# Altium schematic sheet 12.SchDoc
size 513 x 386 mm
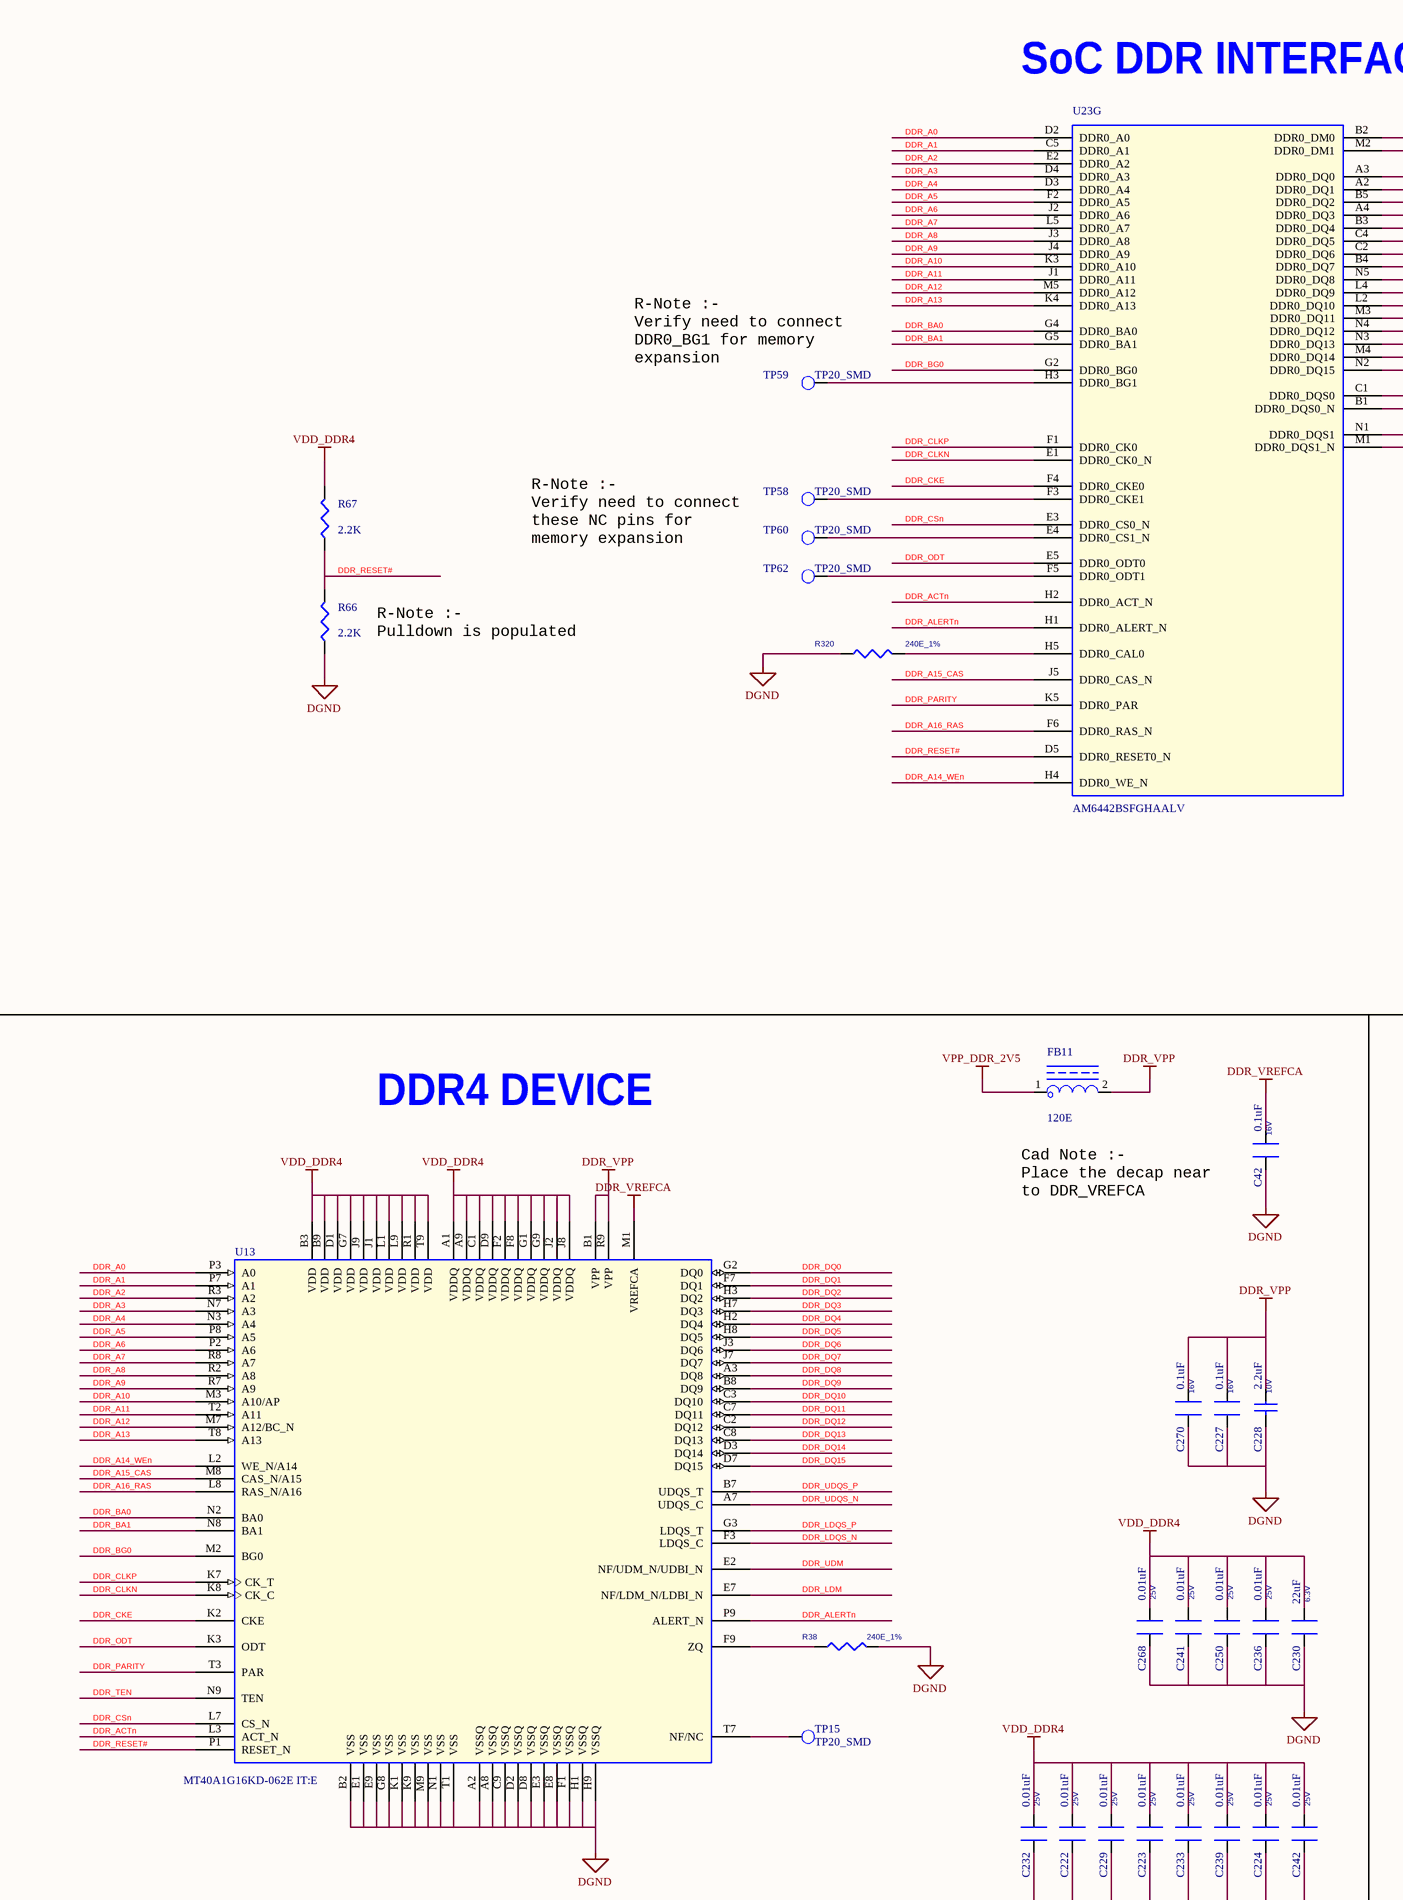
[diagram p0: 12.SchDoc, top left]
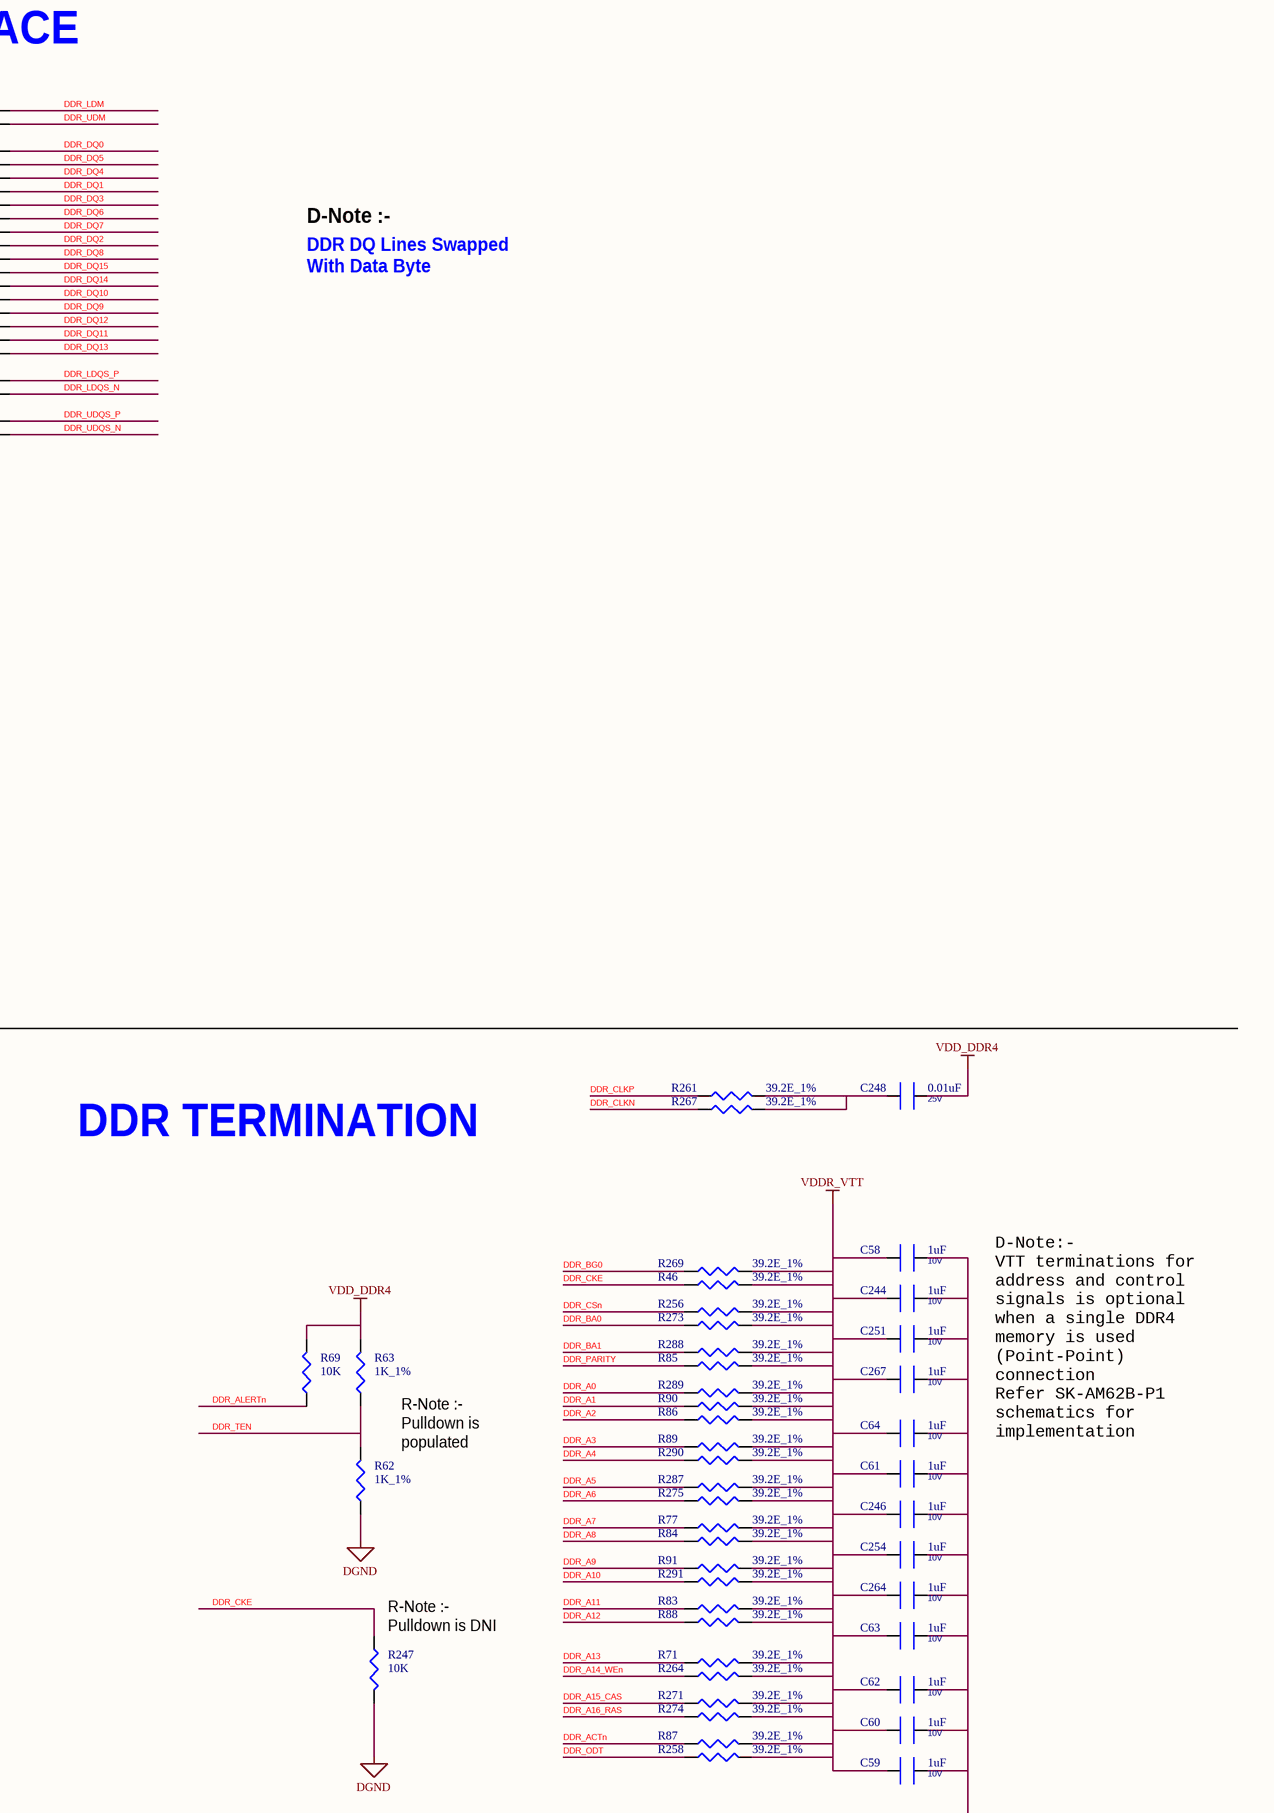
[diagram p1: 12.SchDoc, top right]
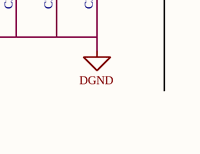
[diagram p2: 12.SchDoc, bottom left]
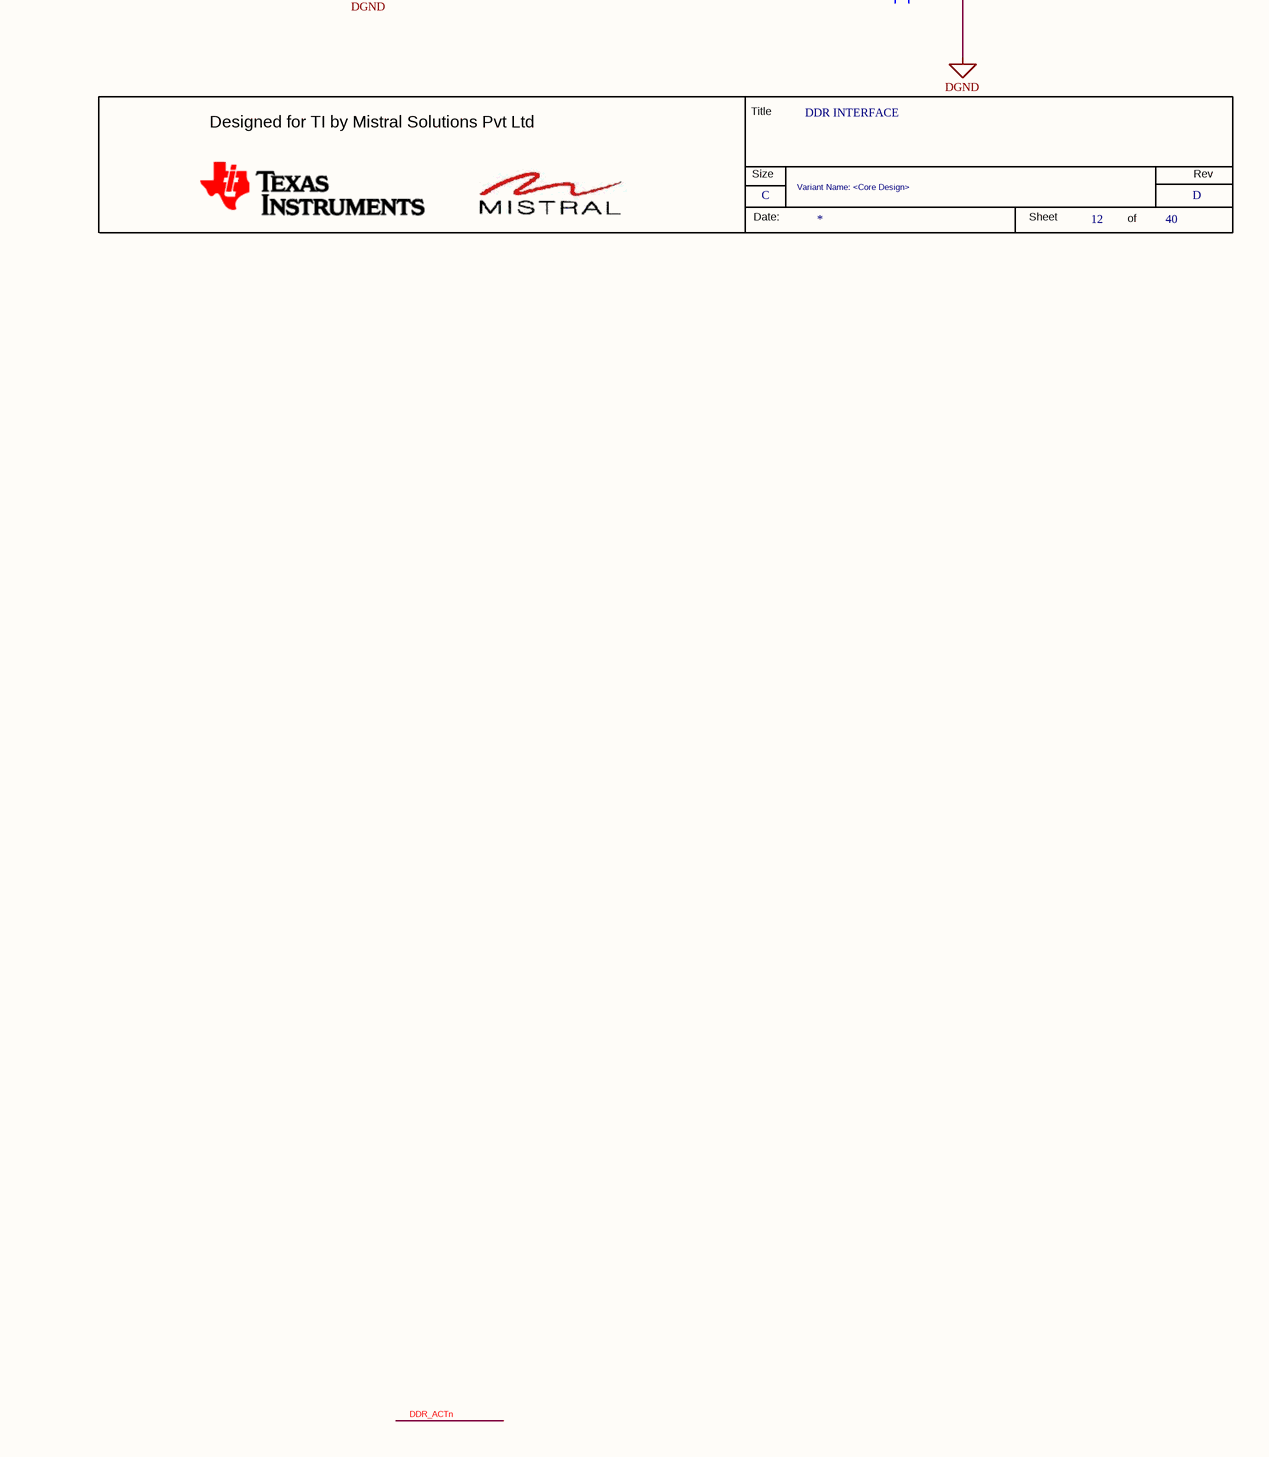
[diagram p3: 12.SchDoc, bottom right]

## Parts
*  RevCode: D  Title: DDR INTERFACE  Page Size: C  Page Number: 12  Page Count: 40  Variant Name: <Core Design>  (hidden comment: MISTRAL_TITLEBLK_CSIZE)  (graphical)
C42  0.1uF  Voltage: 16V  [CAP0402N]
C58  1uF  Voltage: 10V  [CAP0402N]
C59  1uF  Voltage: 10V  [CAP0402N]
C60  1uF  Voltage: 10V  [CAP0402N]
C61  1uF  Voltage: 10V  [CAP0402N]
C62  1uF  Voltage: 10V  [CAP0402N]
C63  1uF  Voltage: 10V  [CAP0402N]
C64  1uF  Voltage: 10V  [CAP0402N]
C222  0.01uF  Voltage: 25V  [CAP0402N]
C223  0.01uF  Voltage: 25V  [CAP0402N]
C224  0.01uF  Voltage: 25V  [CAP0402N]
C227  0.1uF  Voltage: 16V  [CAP0402N]
C228  2.2uF  Voltage: 10V  [CAP0402_0-75]
C229  0.01uF  Voltage: 25V  [CAP0402N]
C230  22uF  Voltage: 6.3V  [CAP0402N]
C232  0.01uF  Voltage: 25V  [CAP0402N]
C233  0.01uF  Voltage: 25V  [CAP0402N]
C236  0.01uF  Voltage: 25V  [CAP0402N]
C239  0.01uF  Voltage: 25V  [CAP0402N]
C241  0.01uF  Voltage: 25V  [CAP0402N]
C242  0.01uF  Voltage: 25V  [CAP0402N]
C244  1uF  Voltage: 10V  [CAP0402N]
C246  1uF  Voltage: 10V  [CAP0402N]
C248  0.01uF  Voltage: 25V  [CAP0402N]
C250  0.01uF  Voltage: 25V  [CAP0402N]
C251  1uF  Voltage: 10V  [CAP0402N]
C254  1uF  Voltage: 10V  [CAP0402N]
C264  1uF  Voltage: 10V  [CAP0402N]
C267  1uF  Voltage: 10V  [CAP0402N]
C268  0.01uF  Voltage: 25V  [CAP0402N]
C270  0.1uF  Voltage: 16V  [CAP0402N]
FB11  120E  [IND0603_1]
R38  240E_1%  [RES0402N]
R46  39.2E_1%  [RES0402_0-5]
R62  1K_1%  [RES0402_0-5]
R63  1K_1%  [RES0402_0-5]
R66  2.2K  [RES0402_0-5]
R67  2.2K  [RES0402_0-5]
R69  10K  [RES0402_0-5]
R71  39.2E_1%  [RES0402_0-5]
R77  39.2E_1%  [RES0402_0-5]
R83  39.2E_1%  [RES0402_0-5]
R84  39.2E_1%  [RES0402_0-5]
R85  39.2E_1%  [RES0402_0-5]
R86  39.2E_1%  [RES0402_0-5]
R87  39.2E_1%  [RES0402_0-5]
R88  39.2E_1%  [RES0402_0-5]
R89  39.2E_1%  [RES0402_0-5]
R90  39.2E_1%  [RES0402_0-5]
R91  39.2E_1%  [RES0402_0-5]
R247  10K  [RES0402_0-5]
R256  39.2E_1%  [RES0402_0-5]
R258  39.2E_1%  [RES0402_0-5]
R261  39.2E_1%  [RES0402_0-5]
R264  39.2E_1%  [RES0402_0-5]
R267  39.2E_1%  [RES0402_0-5]
R269  39.2E_1%  [RES0402_0-5]
R271  39.2E_1%  [RES0402_0-5]
R273  39.2E_1%  [RES0402_0-5]
R274  39.2E_1%  [RES0402_0-5]
R275  39.2E_1%  [RES0402_0-5]
R287  39.2E_1%  [RES0402_0-5]
R288  39.2E_1%  [RES0402_0-5]
R289  39.2E_1%  [RES0402_0-5]
R290  39.2E_1%  [RES0402_0-5]
R291  39.2E_1%  [RES0402_0-5]
R320  240E_1%  [RES0402N]
TP15  TP20_SMD  [TP20_SMD]
TP58  TP20_SMD  [TP20_SMD]
TP59  TP20_SMD  [TP20_SMD]
TP60  TP20_SMD  [TP20_SMD]
TP62  TP20_SMD  [TP20_SMD]
U13  MT40A1G16KD-062E IT:E  [FBGA96_31-49_520X360_1-2]
U23  AM6442BSFGHAALV  [FCBGA441_31-49_680X680_2-6]  (part G of 16)

## Nets
DDR_VPP: C227.2 C228.1 C270.2 FB11.2 U13.B1(VPP) U13.R9(VPP)
DDR_VREFCA: C42.2 U13.M1(VREFCA)
DGND: C42.1 C58.2 C59.2 C60.2 C61.2 C62.2 C63.2 C64.2 C222.2 C223.2 C224.2 C227.1 C228.2 C229.2 C230.2 C232.2 C233.2 C236.2 C239.2 C241.2 C242.2 C244.2 C246.2 C250.2 C251.2 C254.2 C264.2 C267.2 C268.2 C270.1 R38.2 R62.1 R66.1 R247.2 R320.2 U13.A2(VSSQ) U13.A8(VSSQ) U13.B2(VSS) U13.C9(VSSQ) U13.D2(VSSQ) U13.D8(VSSQ) U13.E1(VSS) U13.E3(VSSQ) U13.E8(VSSQ) U13.E9(VSS) U13.F1(VSSQ) U13.G8(VSS) U13.H1(VSSQ) U13.H9(VSSQ) U13.K1(VSS) U13.K9(VSS) U13.M9(VSS) U13.N1(VSS) U13.T1(VSS)
VDD_DDR4: C222.1 C223.1 C224.1 C229.1 C230.1 C232.1 C233.1 C236.1 C239.1 C241.1 C242.1 C248.2 C250.1 C268.1 R63.2 R67.2 R69.2 U13.A1(VDDQ) U13.A9(VDDQ) U13.B3(VDD) U13.B9(VDD) U13.C1(VDDQ) U13.D1(VDD) U13.D9(VDDQ) U13.F2(VDDQ) U13.F8(VDDQ) U13.G1(VDDQ) U13.G7(VDD) U13.G9(VDDQ) U13.J1(VDD) U13.J2(VDDQ) U13.J8(VDDQ) U13.J9(VDD) U13.L1(VDD) U13.L9(VDD) U13.R1(VDD) U13.T9(VDD)
VDDR_VTT: C58.1 C59.1 C60.1 C61.1 C62.1 C63.1 C64.1 C244.1 C246.1 C251.1 C254.1 C264.1 C267.1 R46.2 R71.2 R77.2 R83.2 R84.2 R85.2 R86.2 R87.2 R88.2 R89.2 R90.2 R91.2 R256.2 R258.2 R264.2 R269.2 R271.2 R273.2 R274.2 R275.2 R287.2 R288.2 R289.2 R290.2 R291.2
VPP_DDR_2V5: FB11.1
DDR_A0: R289.1 U13.P3(A0) U23.D2(DDR0_A0)
DDR_A1: R90.1 U13.P7(A1) U23.C5(DDR0_A1)
DDR_A2: R86.1 U13.R3(A2) U23.E2(DDR0_A2)
DDR_A3: R89.1 U13.N7(A3) U23.D4(DDR0_A3)
DDR_A4: R290.1 U13.N3(A4) U23.D3(DDR0_A4)
DDR_A5: R287.1 U13.P8(A5) U23.F2(DDR0_A5)
DDR_A6: R275.1 U13.P2(A6) U23.J2(DDR0_A6)
DDR_A7: R77.1 U13.R8(A7) U23.L5(DDR0_A7)
DDR_A8: R84.1 U13.R2(A8) U23.J3(DDR0_A8)
DDR_A9: R91.1 U13.R7(A9) U23.J4(DDR0_A9)
DDR_A10: R291.1 U13.M3(A10/AP) U23.K3(DDR0_A10)
DDR_A11: R83.1 U13.T2(A11) U23.J1(DDR0_A11)
DDR_A12: R88.1 U13.M7(A12/BC_N) U23.M5(DDR0_A12)
DDR_A13: R71.1 U13.T8(A13) U23.K4(DDR0_A13)
DDR_A14_WEn: R264.1 U13.L2(WE_N/A14) U23.H4(DDR0_WE_N)
DDR_A15_CAS: R271.1 U13.M8(CAS_N/A15) U23.J5(DDR0_CAS_N)
DDR_A16_RAS: R274.1 U13.L8(RAS_N/A16) U23.F6(DDR0_RAS_N)
DDR_ACTn: R87.1 U13.L3(ACT_N) U23.H2(DDR0_ACT_N)
DDR_ALERTn: R69.1 U13.P9(ALERT_N) U23.H1(DDR0_ALERT_N)
DDR_BA0: R273.1 U13.N2(BA0) U23.G4(DDR0_BA0)
DDR_BA1: R288.1 U13.N8(BA1) U23.G5(DDR0_BA1)
DDR_BG0: R269.1 U13.M2(BG0) U23.G2(DDR0_BG0)
DDR_CKE: R46.1 R247.1 U13.K2(CKE) U23.F4(DDR0_CKE0)
DDR_CLKN: R267.1 U13.K8(CK_C) U23.E1(DDR0_CK0_N)
DDR_CLKP: R261.1 U13.K7(CK_T) U23.F1(DDR0_CK0)
DDR_CSn: R256.1 U13.L7(CS_N) U23.E3(DDR0_CS0_N)
DDR_DQ0: U13.G2(DQ0) U23.A3(DDR0_DQ0)
DDR_DQ1: U13.F7(DQ1) U23.A4(DDR0_DQ3)
DDR_DQ2: U13.H3(DQ2) U23.B4(DDR0_DQ7)
DDR_DQ3: U13.H7(DQ3) U23.B3(DDR0_DQ4)
DDR_DQ4: U13.H2(DQ4) U23.B5(DDR0_DQ2)
DDR_DQ5: U13.H8(DQ5) U23.A2(DDR0_DQ1)
DDR_DQ6: U13.J3(DQ6) U23.C4(DDR0_DQ5)
DDR_DQ7: U13.J7(DQ7) U23.C2(DDR0_DQ6)
DDR_DQ8: U13.A3(DQ8) U23.N5(DDR0_DQ8)
DDR_DQ9: U13.B8(DQ9) U23.N4(DDR0_DQ12)
DDR_DQ10: U13.C3(DQ10) U23.M3(DDR0_DQ11)
DDR_DQ11: U13.C7(DQ11) U23.M4(DDR0_DQ14)
DDR_DQ12: U13.C2(DQ12) U23.N3(DDR0_DQ13)
DDR_DQ13: U13.C8(DQ13) U23.N2(DDR0_DQ15)
DDR_DQ14: U13.D3(DQ14) U23.L2(DDR0_DQ10)
DDR_DQ15: U13.D7(DQ15) U23.L4(DDR0_DQ9)
DDR_LDM: U13.E7(NF/LDM_N/LDBI_N) U23.B2(DDR0_DM0)
DDR_LDQS_N: U13.F3(LDQS_C) U23.B1(DDR0_DQS0_N)
DDR_LDQS_P: U13.G3(LDQS_T) U23.C1(DDR0_DQS0)
DDR_ODT: R258.1 U13.K3(ODT) U23.E5(DDR0_ODT0)
DDR_PARITY: R85.1 U13.T3(PAR) U23.K5(DDR0_PAR)
DDR_RESET#: R66.2 R67.1 U13.P1(RESET_N) U23.D5(DDR0_RESET0_N)
DDR_TEN: R62.2 R63.1 U13.N9(TEN)
DDR_UDM: U13.E2(NF/UDM_N/UDBI_N) U23.M2(DDR0_DM1)
DDR_UDQS_N: U13.A7(UDQS_C) U23.M1(DDR0_DQS1_N)
DDR_UDQS_P: U13.B7(UDQS_T) U23.N1(DDR0_DQS1)
NetC248_1: C248.1 R261.2 R267.2
NetR38_1: R38.1 U13.F9(ZQ)
NetR320_1: R320.1 U23.H5(DDR0_CAL0)
NetTP15_1: TP15.1(TP) U13.T7(NF/NC)
NetTP58_1: TP58.1(TP) U23.F3(DDR0_CKE1)
NetTP59_1: TP59.1(TP) U23.H3(DDR0_BG1)
NetTP60_1: TP60.1(TP) U23.E4(DDR0_CS1_N)
NetTP62_1: TP62.1(TP) U23.F5(DDR0_ODT1)

## Notes on the sheet
- SoC DDR INTERFACE
- DDR DQ Lines Swapped
  With Data Byte
- D-Note :-
- (near TP59) R-Note :-
  Verify need to connect
  DDR0_BG1 for memory
  expansion
- R-Note :-
  Verify need to connect
  these NC pins for
  memory expansion
- R-Note :-
  Pulldown is populated
- DDR4 DEVICE
- Cad Note :-
  Place the decap near
  to DDR_VREFCA
- DDR TERMINATION
- D-Note:-
  VTT terminations for
  address and control
  signals is optional
  when a single DDR4
  memory is used
  (Point-Point)
  connection
  Refer SK-AM62B-P1
  schematics for
  implementation
- R-Note :-
  Pulldown is
  populated
- (near R247) R-Note :-
  Pulldown is DNI
- (in symbol MISTRAL_TITLEBLK_CSIZE) Title; Designed for TI by Mistral Solutions Pvt Ltd; Size; Rev; Date:; Sheet; of

## Library data of the parts
* = MISTRAL_TITLEBLK_CSIZE: Issue: 1.0; Page Create Date: March  8, 1995; Page Modify Date: *
C42 = CAP_Dup2: CAP CERAMIC 0.1uF 16V 10% X5R 0201; Mistral Part No: 120009030072-R; Mfr_name: MURATA; Mfr_part_number: GRM033R61C104KE84J; Part_type: CAPACITORS\CERAMIC; MECHANICAL 3D STEP FILE: CAP0201_0-5; Wattage: NA; Project: TI_MAXIE_CPB; Customs_HS_Code: 85322990; Custom_Duty: 15%; Library Ref: CAP; Temperature: -55癈+85癈; Weight: 0.33mg; Tolerance: 10%; Package: 0201; Distributor_name: DIGIKEY; Distributor_part_number: 490-16742-1-ND; Height: 0.33MM; Datasheet: Y:\MIS_DATABASE\DATASHEETS\CAPACITORS\GRM033R61C104KE84.PDF; Crtd /date: MANIRAJA/120218; Chkd/date: MANIRAJA/120218; Footprint Ref: CAP0201_0-5; Library Path: Y:\MIS_DATABASE\Library\ALTIUM_TOOL\SCHEMATICS_PARTS\MS_DISCRETE_Library.schlib; Footprint Path: Y:\MIS_DATABASE\Library\ALTIUM_TOOL\PCB_FOOTPRINTS\Altium_Footprint_Lib.PcbLib; PCB Footprint: CAP0201_0-5
C58 C244 C267 = CAP_Dup2: CAP CERAMIC 1uF 10V 20% X5R 0402; Part_type: CAPACITORS\CERAMIC; Mfr_part_number: 885012105012; Mfr_name: WURTH ELECTRONICS; Mistral Part No: 120020080009-R; Custom_Duty: 15%; Customs_HS_Code: 85322990; Project: AM64x_EVM_BRD; Wattage: NA; MECHANICAL 3D STEP FILE: CAP0402_0-75; Chkd/date: MANIRAJA/210820; Crtd /date: ALVY/190820; Datasheet: Y:\MIS_DATABASE\DATASHEETS\CAPACITORS\885012105012.PDF; Height: 0.55MM; Distributor_part_number: 732-7489-1-ND; Distributor_name: DIGIKEY; Package: 0402; Tolerance: 20%; Weight: 0.65mg; Temperature: -55癈+85癈; Library Ref: CAP; Footprint Ref: CAP0402_0-75; Library Path: Y:\MIS_DATABASE\Library\ALTIUM_TOOL\SCHEMATICS_PARTS\MS_DISCRETE_Library.schlib; Footprint Path: Y:\MIS_DATABASE\Library\ALTIUM_TOOL\PCB_FOOTPRINTS\Altium_Footprint_Lib.PcbLib; PCB Footprint: CAP0402_0-75
C59 C62 C251 = CAP_Dup2: CAP CERAMIC 1uF 10V 20% X5R 0402; Mistral Part No: 120020080009-R; Mfr_name: WURTH ELECTRONICS; Mfr_part_number: 885012105012; Part_type: CAPACITORS\CERAMIC; Project: AM64x_EVM_BRD; Customs_HS_Code: 85322990; Custom_Duty: 15%; Wattage: NA; MECHANICAL 3D STEP FILE: CAP0402_0-75; Footprint Path: Y:\MIS_DATABASE\Library\ALTIUM_TOOL\PCB_FOOTPRINTS\Altium_Footprint_Lib.PcbLib; Library Path: Y:\MIS_DATABASE\Library\ALTIUM_TOOL\SCHEMATICS_PARTS\MS_DISCRETE_Library.schlib; Footprint Ref: CAP0402_0-75; Library Ref: CAP; Tolerance: 20%; Package: 0402; Distributor_name: DIGIKEY; Distributor_part_number: 732-7489-1-ND; Height: 0.55MM; Datasheet: Y:\MIS_DATABASE\DATASHEETS\CAPACITORS\885012105012.PDF; Crtd /date: ALVY/190820; Chkd/date: MANIRAJA/210820; Weight: 0.65mg; Temperature: -55癈+85癈; PCB Footprint: CAP0402_0-75
C60 C61 C63 C64 C246 C254 C264 = CAP_Dup2: CAP CERAMIC 1uF 10V 20% X5R 0402; Part_type: CAPACITORS\CERAMIC; Mfr_part_number: 885012105012; Mfr_name: WURTH ELECTRONICS; Mistral Part No: 120020080009-R; MECHANICAL 3D STEP FILE: CAP0402_0-75; Wattage: NA; Custom_Duty: 15%; Customs_HS_Code: 85322990; Project: AM64x_EVM_BRD; Footprint Path: Y:\MIS_DATABASE\Library\ALTIUM_TOOL\PCB_FOOTPRINTS\Altium_Footprint_Lib.PcbLib; Library Path: Y:\MIS_DATABASE\Library\ALTIUM_TOOL\SCHEMATICS_PARTS\MS_DISCRETE_Library.schlib; Footprint Ref: CAP0402_0-75; Library Ref: CAP; Temperature: -55癈+85癈; Weight: 0.65mg; Chkd/date: MANIRAJA/210820; Crtd /date: ALVY/190820; Datasheet: Y:\MIS_DATABASE\DATASHEETS\CAPACITORS\885012105012.PDF; Height: 0.55MM; Distributor_part_number: 732-7489-1-ND; Distributor_name: DIGIKEY; Package: 0402; Tolerance: 20%; PCB Footprint: CAP0402_0-75
C222-C224 C229 C232 C233 C236 C239 C241 C250 C268 = CAP_Dup2: CAP CERAMIC 0.01uF 25V 10% X5R 0201; Part_type: CAPACITORS\CERAMIC; Mfr_part_number: GRM033R61E103KA12J; Mfr_name: MURATA; Mistral Part No: 120018010007-R; MECHANICAL 3D STEP FILE: CAP0201_0-5; Wattage: NA; Custom_Duty: 15%; Customs_HS_Code: 85322990; Project: TI_MAXIE_CPB; Footprint Path: Y:\MIS_DATABASE\Library\ALTIUM_TOOL\PCB_FOOTPRINTS\Altium_Footprint_Lib.PcbLib; Library Path: Y:\MIS_DATABASE\Library\ALTIUM_TOOL\SCHEMATICS_PARTS\MS_DISCRETE_Library.schlib; Footprint Ref: CAP0201_0-5; Library Ref: CAP; Temperature: -55癈+85癈; Weight: 0.33mg; Chkd/date: MANIRAJA/230118; Crtd /date: MANIRAJA/230118; Datasheet: Y:\MIS_DATABASE\DATASHEETS\CAPACITORS\GRM033R61E103KA12.PDF; Height: 0.33MM; Distributor_part_number: GRM033R61E103KA12J-ND; Distributor_name: DIGIKEY; Package: 0201; Tolerance: 10%; PCB Footprint: CAP0201_0-5
C227 C270 = CAP_Dup2: CAP CERAMIC 0.1uF 16V 10% X5R 0201; Part_type: CAPACITORS\CERAMIC; Mfr_part_number: GRM033R61C104KE84J; Mfr_name: MURATA; Mistral Part No: 120009030072-R; Custom_Duty: 15%; Customs_HS_Code: 85322990; Project: TI_MAXIE_CPB; Wattage: NA; MECHANICAL 3D STEP FILE: CAP0201_0-5; Footprint Path: Y:\MIS_DATABASE\Library\ALTIUM_TOOL\PCB_FOOTPRINTS\Altium_Footprint_Lib.PcbLib; Library Path: Y:\MIS_DATABASE\Library\ALTIUM_TOOL\SCHEMATICS_PARTS\MS_DISCRETE_Library.schlib; Footprint Ref: CAP0201_0-5; Chkd/date: MANIRAJA/120218; Crtd /date: MANIRAJA/120218; Datasheet: Y:\MIS_DATABASE\DATASHEETS\CAPACITORS\GRM033R61C104KE84.PDF; Height: 0.33MM; Distributor_part_number: 490-16742-1-ND; Distributor_name: DIGIKEY; Package: 0201; Tolerance: 10%; Weight: 0.33mg; Temperature: -55癈+85癈; Library Ref: CAP; PCB Footprint: CAP0201_0-5
C228 = CAP_Dup3: CAP CERAMIC 2.2uF 10V 20% X5R 0402; Mistral Part No: 120019040036-R; Mfr_name: WURTH ELECTRONICS; Mfr_part_number: 885012105013; Part_type: CAPACITORS\CERAMIC; Project: AM64x_EVM_BRD; Wattage: NA; Customs_HS_Code: 85322990; Custom_Duty: 15%; Footprint Path: Y:\MIS_DATABASE\Library\ALTIUM_TOOL\PCB_FOOTPRINTS\Altium_Footprint_Lib.PcbLib; Library Path: Y:\MIS_DATABASE\Library\ALTIUM_TOOL\SCHEMATICS_PARTS\MS_DISCRETE_Library.schlib; Footprint Ref: CAP0402_0-75; Library Ref: CAP; Tolerance: 20%; Package: 0402; Distributor_name: DIGIKEY; Distributor_part_number: 732-7490-1-ND; Height: 0.55MM; Weight: 0.65mg; Temperature: -55癈+85癈; Datasheet: Y:\MIS_DATABASE\DATASHEETS\CAPACITORS\885012105013.PDF; Crtd /date: ALVY/170820; Chkd/date: MANIRAJA/170820; MECHANICAL 3D STEP FILE: CAP0402_0-75; PCB Footprint: CAP0402_0-75
C230 = CAP_Dup2: CAP CERAMIC 22uF 6.3V 20% X5R 0603; Mistral Part No: 120015090007-R; Mfr_name: MURATA; Mfr_part_number: GRM188R60J226MEA0; Part_type: CAPACITORS\CERAMIC; MECHANICAL 3D STEP FILE: CAP0603_1; Project: OCTBTS_3000; Wattage: NA; Customs_HS_Code: 85322990; Custom_Duty: 15%; Footprint Path: Y:\MIS_DATABASE\Library\ALTIUM_TOOL\PCB_FOOTPRINTS\Altium_Footprint_Lib.PcbLib; Library Path: Y:\MIS_DATABASE\Library\ALTIUM_TOOL\SCHEMATICS_PARTS\MS_DISCRETE_Library.schlib; Footprint Ref: CAP0603_1; Library Ref: CAP; Tolerance: 20%; Package: 0603; Distributor_name: DIGIKEY; Distributor_part_number: 490-7611-2-ND; Height: 1.00MM; Weight: 6.3mg; Temperature: -55癈+85癈; Datasheet: Y:\MIS_DATABASE\DATASHEETS\CAPACITORS\MURATA-GXX-SER_NOV17.PDF; Crtd /date: JEBRAN/090915; Chkd/date: JEBRAN/090915; PCB Footprint: CAP0603_1
C242 = CAP_Dup2: CAP CERAMIC 0.01uF 25V 10% X5R 0201; Mistral Part No: 120018010007-R; Mfr_name: MURATA; Mfr_part_number: GRM033R61E103KA12J; Part_type: CAPACITORS\CERAMIC; MECHANICAL 3D STEP FILE: CAP0201_0-5; Wattage: NA; Project: TI_MAXIE_CPB; Customs_HS_Code: 85322990; Custom_Duty: 15%; Footprint Path: Y:\MIS_DATABASE\Library\ALTIUM_TOOL\PCB_FOOTPRINTS\Altium_Footprint_Lib.PcbLib; Library Path: Y:\MIS_DATABASE\Library\ALTIUM_TOOL\SCHEMATICS_PARTS\MS_DISCRETE_Library.schlib; Footprint Ref: CAP0201_0-5; Library Ref: CAP; Temperature: -55癈+85癈; Weight: 0.33mg; Tolerance: 10%; Package: 0201; Distributor_name: DIGIKEY; Distributor_part_number: GRM033R61E103KA12J-ND; Height: 0.33MM; Datasheet: Y:\MIS_DATABASE\DATASHEETS\CAPACITORS\GRM033R61E103KA12.PDF; Crtd /date: MANIRAJA/230118; Chkd/date: MANIRAJA/230118; PCB Footprint: CAP0201_0-5
C248 = CAP_Dup2: CAP CERAMIC 0.01uF 25V 10% X5R 0201; Mistral Part No: 120018010007-R; Mfr_name: MURATA; Mfr_part_number: GRM033R61E103KA12J; Part_type: CAPACITORS\CERAMIC; Project: TI_MAXIE_CPB; Customs_HS_Code: 85322990; Custom_Duty: 15%; Wattage: NA; MECHANICAL 3D STEP FILE: CAP0201_0-5; Footprint Path: Y:\MIS_DATABASE\Library\ALTIUM_TOOL\PCB_FOOTPRINTS\Altium_Footprint_Lib.PcbLib; Library Path: Y:\MIS_DATABASE\Library\ALTIUM_TOOL\SCHEMATICS_PARTS\MS_DISCRETE_Library.schlib; Footprint Ref: CAP0201_0-5; Tolerance: 10%; Package: 0201; Distributor_name: DIGIKEY; Distributor_part_number: GRM033R61E103KA12J-ND; Height: 0.33MM; Datasheet: Y:\MIS_DATABASE\DATASHEETS\CAPACITORS\GRM033R61E103KA12.PDF; Crtd /date: MANIRAJA/230118; Chkd/date: MANIRAJA/230118; Weight: 0.33mg; Temperature: -55癈+85癈; Library Ref: CAP; PCB Footprint: CAP0201_0-5
FB11 = INDUCTOR_FERRITE: IND FERRITE BEAD CHIP 120E 2A 0603; Mistral Part No: 130020080015-R; Mfr_name: WURTH ELECTRONICS; Mfr_part_number: 782631141; Project: AM64x_EVM_BRD; Tolerance: 25%; Voltage: NA; Customs_HS_Code: 85437099; Custom_Duty: 24%; PCB Footprint: IND0603_1; Footprint Ref: IND0603_1; Part_type: INDUCTOR; Wattage: NA; Package: 0603; Distributor_name: DIGIKEY; Distributor_part_number: 732-782631141CT-ND; Library Ref: INDUCTOR_FERRITE; Height: 1.00MM; Weight: NA; Temperature: -55癈+125癈; Datasheet: Y:\MIS_DATABASE\DATASHEETS\DISCRETES\INDUCTORS\782631141.PDF; Crtd /date: ALVY/180820; Chkd/date: MANIRAJA/180820; MECHANICAL 3D STEP FILE: IND0603_1; Library Path: Y:\MIS_DATABASE\Library\ALTIUM_TOOL\SCHEMATICS_PARTS\MS_FILTER_Library.schlib; Footprint Path: Y:\MIS_DATABASE\Library\ALTIUM_TOOL\PCB_FOOTPRINTS\Altium_Footprint_Lib.PcbLib
R38 = RESISTOR_Dup2: RES 240E 1/10W 1% 0402; Mistral Part No: 110011060017-R; Mfr_name: PANASONIC-ECG; Mfr_part_number: ERJ-2RKF2400X; Part_type: RESISTORS\FIXED; Project: AM4515_EVM_LCD; Voltage: NA; Customs_HS_Code: 85332119; Custom_Duty: 15%; MECHANICAL 3D STEP FILE: RES0402_0-5; Library Ref: RESISTOR; Tolerance: 1%; Wattage: 1/10W; Package: 0402; Distributor_name: DIGIKEY; Distributor_part_number: P240LCT-ND; Height: 0.40MM; Weight: 0.8mg; Temperature: -55癈+155癈; Datasheet: Y:\MIS_DATABASE\DATASHEETS\RESISTORS\PAN-ERJSER_NOV17.PDF; Crtd /date: BAVISH/020611; Chkd/date: MAZHAR/150611; Footprint Ref: RES0402_0-5; Library Path: Y:\MIS_DATABASE\Library\ALTIUM_TOOL\SCHEMATICS_PARTS\MS_DISCRETE_Library.schlib; Footprint Path: Y:\MIS_DATABASE\Library\ALTIUM_TOOL\PCB_FOOTPRINTS\Altium_Footprint_Lib.PcbLib; PCB Footprint: RES0402_0-5
R46 R71 R77 R83 R84 R87-R89 R264 R269 R274 R275 R287 R288 R290 = RESISTOR_Dup6: RES 39.2E 1/16W 1% 0402; Part_type: RESISTORS\FIXED; Mfr_part_number: RMCF0402FT39R2; Mfr_name: STACKPOLE ELECTRONICS; Mistral Part No: 110011040030-R; Custom_Duty: 15%; Customs_HS_Code: 85332119; Voltage: NA; Project: AOD_POD-BASECARD; Footprint Path: Y:\MIS_DATABASE\Library\ALTIUM_TOOL\PCB_FOOTPRINTS\Altium_Footprint_Lib.PcbLib; Library Path: Y:\MIS_DATABASE\Library\ALTIUM_TOOL\SCHEMATICS_PARTS\MS_DISCRETE_Library.schlib; MECHANICAL 3D STEP FILE: RES0402_0-5; Footprint Ref: RES0402_0-5; Library Ref: RESISTOR; Chkd/date: RAGESH/210411; Crtd /date: MAZHAR/210411; Datasheet: Y:\MIS_DATABASE\DATASHEETS\RESISTORS\RMCF-SER_JUL18.PDF; Temperature: -55癈+155癈; Weight: 0.57mg; Height: 0.40MM; Distributor_part_number: RMCF0402FT39R2CT-ND; Distributor_name: DIGIKEY; Package: 0402; Wattage: 1/16W; Tolerance: 1%; PCB Footprint: RES0402_0-5
R62 = RESISTOR_Dup5: RES 1K 1/10W 1% 0402; Part_type: RESISTORS\FIXED; Mfr_part_number: ERJ-2RKF1001X; Mfr_name: PANASONIC-ECG; Mistral Part No: 110009030411-R; Custom_Duty: 15%; Customs_HS_Code: 85332119; Voltage: NA; Project: VOCERA; PCB Footprint: RES0402_0-5; Chkd/date: VASANTHA/281216; Crtd /date: MAZHAR/150506; Datasheet: Y:\MIS_DATABASE\DATASHEETS\RESISTORS\PAN-ERJSER_NOV17.PDF; Temperature: -55癈+155癈; Weight: 0.8mg; Height: 0.40MM; Distributor_part_number: P1.00KLCT-ND; Distributor_name: DIGIKEY; Package: 0402; Wattage: 1/10W; Tolerance: 1%; Library Ref: RESISTOR; Footprint Ref: RES0402_0-5; MECHANICAL 3D STEP FILE: RES0402_0-5; Library Path: Y:\MIS_DATABASE\Library\ALTIUM_TOOL\SCHEMATICS_PARTS\MS_DISCRETE_Library.schlib; Footprint Path: Y:\MIS_DATABASE\Library\ALTIUM_TOOL\PCB_FOOTPRINTS\Altium_Footprint_Lib.PcbLib
R63 = RESISTOR_Dup5: RES 1K 1/10W 1% 0402; Mistral Part No: 110009030411-R; Mfr_name: PANASONIC-ECG; Mfr_part_number: ERJ-2RKF1001X; Part_type: RESISTORS\FIXED; Project: VOCERA; Voltage: NA; Customs_HS_Code: 85332119; Custom_Duty: 15%; PCB Footprint: RES0402_0-5; Footprint Path: Y:\MIS_DATABASE\Library\ALTIUM_TOOL\PCB_FOOTPRINTS\Altium_Footprint_Lib.PcbLib; Library Path: Y:\MIS_DATABASE\Library\ALTIUM_TOOL\SCHEMATICS_PARTS\MS_DISCRETE_Library.schlib; MECHANICAL 3D STEP FILE: RES0402_0-5; Footprint Ref: RES0402_0-5; Library Ref: RESISTOR; Tolerance: 1%; Wattage: 1/10W; Package: 0402; Distributor_name: DIGIKEY; Distributor_part_number: P1.00KLCT-ND; Height: 0.40MM; Weight: 0.8mg; Temperature: -55癈+155癈; Datasheet: Y:\MIS_DATABASE\DATASHEETS\RESISTORS\PAN-ERJSER_NOV17.PDF; Crtd /date: MAZHAR/150506; Chkd/date: VASANTHA/281216
R66 R67 = RESISTOR_Dup6: RES 2.2K 1/16W 5% 0402; Mistral Part No: 110010120018-R; Mfr_name: YAGEO AMERICA; Mfr_part_number: RC0402JR-072K2L; Part_type: RESISTORS\FIXED; Project: TE4; Voltage: NA; Customs_HS_Code: 85332119; Custom_Duty: 15%; PCB Footprint: RES0402_0-5; Library Path: Y:\MIS_DATABASE\Library\ALTIUM_TOOL\SCHEMATICS_PARTS\MS_DISCRETE_Library.schlib; Footprint Ref: RES0402_0-5; Footprint Path: Y:\MIS_DATABASE\Library\ALTIUM_TOOL\PCB_FOOTPRINTS\Altium_Footprint_Lib.PcbLib; Tolerance: 5%; Wattage: 1/16W; Package: 0402; Distributor_name: DIGIKEY; Distributor_part_number: 311-2.2KJRCT-ND; Height: 0.40MM; Weight: 0.65mg; Temperature: -55癈+155癈; Datasheet: Y:\MIS_DATABASE\DATASHEETS\RESISTORS\RCXXXXL-SER_MAR18.PDF; Crtd /date: BAVISH/021210; Chkd/date: VASANTHA/061216; MECHANICAL 3D STEP FILE: RES0402_0-5; Library Ref: RESISTOR
R69 = RESISTOR_Dup6: RES 10K 1/16W 5% 0402; Part_type: RESISTORS\FIXED; Mfr_part_number: RC0402JR-0710KL; Mfr_name: YAGEO AMERICA; Mistral Part No: 110011060021-R; Custom_Duty: 15%; Customs_HS_Code: 85332119; Voltage: NA; Project: HSE; PCB Footprint: RES0402_0-5; MECHANICAL 3D STEP FILE: RES0402_0-5; Chkd/date: VASANTHA/061216; Crtd /date: MAZHAR/230805; Datasheet: Y:\MIS_DATABASE\DATASHEETS\RESISTORS\RCXXXXL-SER_MAR18.PDF; Temperature: -55癈+155癈; Weight: 0.65mg; Height: 0.40MM; Distributor_part_number: 311-10KJRCT-ND; Distributor_name: DIGIKEY; Package: 0402; Wattage: 1/16W; Tolerance: 5%; Library Ref: RESISTOR; Footprint Ref: RES0402_0-5; Library Path: Y:\MIS_DATABASE\Library\ALTIUM_TOOL\SCHEMATICS_PARTS\MS_DISCRETE_Library.schlib; Footprint Path: Y:\MIS_DATABASE\Library\ALTIUM_TOOL\PCB_FOOTPRINTS\Altium_Footprint_Lib.PcbLib
R85 R86 R90 R91 R256 R258 R261 R267 R271 R273 R289 R291 = RESISTOR_Dup6: RES 39.2E 1/16W 1% 0402; Mistral Part No: 110011040030-R; Mfr_name: STACKPOLE ELECTRONICS; Mfr_part_number: RMCF0402FT39R2; Part_type: RESISTORS\FIXED; Project: AOD_POD-BASECARD; Voltage: NA; Customs_HS_Code: 85332119; Custom_Duty: 15%; Footprint Path: Y:\MIS_DATABASE\Library\ALTIUM_TOOL\PCB_FOOTPRINTS\Altium_Footprint_Lib.PcbLib; Library Path: Y:\MIS_DATABASE\Library\ALTIUM_TOOL\SCHEMATICS_PARTS\MS_DISCRETE_Library.schlib; MECHANICAL 3D STEP FILE: RES0402_0-5; Footprint Ref: RES0402_0-5; Library Ref: RESISTOR; Tolerance: 1%; Wattage: 1/16W; Package: 0402; Distributor_name: DIGIKEY; Distributor_part_number: RMCF0402FT39R2CT-ND; Height: 0.40MM; Weight: 0.57mg; Temperature: -55癈+155癈; Datasheet: Y:\MIS_DATABASE\DATASHEETS\RESISTORS\RMCF-SER_JUL18.PDF; Crtd /date: MAZHAR/210411; Chkd/date: RAGESH/210411; PCB Footprint: RES0402_0-5
R247 = RESISTOR_Dup6: RES 10K 1/16W 5% 0402; Mistral Part No: 110011060021-R; Mfr_name: YAGEO AMERICA; Mfr_part_number: RC0402JR-0710KL; Part_type: RESISTORS\FIXED; Project: HSE; Voltage: NA; Customs_HS_Code: 85332119; Custom_Duty: 15%; PCB Footprint: RES0402_0-5; Footprint Path: Y:\MIS_DATABASE\Library\ALTIUM_TOOL\PCB_FOOTPRINTS\Altium_Footprint_Lib.PcbLib; Library Path: Y:\MIS_DATABASE\Library\ALTIUM_TOOL\SCHEMATICS_PARTS\MS_DISCRETE_Library.schlib; Footprint Ref: RES0402_0-5; Library Ref: RESISTOR; Tolerance: 5%; Wattage: 1/16W; Package: 0402; Distributor_name: DIGIKEY; Distributor_part_number: 311-10KJRCT-ND; Height: 0.40MM; Weight: 0.65mg; Temperature: -55癈+155癈; Datasheet: Y:\MIS_DATABASE\DATASHEETS\RESISTORS\RCXXXXL-SER_MAR18.PDF; Crtd /date: MAZHAR/230805; Chkd/date: VASANTHA/061216; MECHANICAL 3D STEP FILE: RES0402_0-5
R320 = RESISTOR_Dup2: RES 240E 1/10W 1% 0402; Part_type: RESISTORS\FIXED; Mfr_part_number: ERJ-2RKF2400X; Mfr_name: PANASONIC-ECG; Mistral Part No: 110011060017-R; PCB Footprint: RES0402_0-5; Custom_Duty: 15%; Customs_HS_Code: 85332119; Voltage: NA; Project: AM4515_EVM_LCD; Library Ref: RESISTOR; Chkd/date: MAZHAR/150611; Crtd /date: BAVISH/020611; Datasheet: Y:\MIS_DATABASE\DATASHEETS\RESISTORS\PAN-ERJSER_NOV17.PDF; Temperature: -55癈+155癈; Weight: 0.8mg; Height: 0.40MM; Distributor_part_number: P240LCT-ND; Distributor_name: DIGIKEY; Package: 0402; Wattage: 1/10W; Tolerance: 1%; Footprint Ref: RES0402_0-5; MECHANICAL 3D STEP FILE: RES0402_0-5; Library Path: Y:\MIS_DATABASE\Library\ALTIUM_TOOL\SCHEMATICS_PARTS\MS_DISCRETE_Library.schlib; Footprint Path: Y:\MIS_DATABASE\Library\ALTIUM_TOOL\PCB_FOOTPRINTS\Altium_Footprint_Lib.PcbLib
TP15 TP59 = TESTPOINT: TESTPOINT CIR 20 SMD; Mfr_name: LOCAL; Custom_Duty: NA; Project: BT MODULE_CSRBC04; PCB Footprint: TP20_SMD; Customs_HS_Code: NA; Chkd/date: SHREESHAIL/171006; Crtd /date: MAZHAR/171006; Height: NA; Distributor_part_number: NA; Distributor_name: NA; Package: SMD; Part_type: TESTPOINT; Mfr_part_number: TP20_SMD; Mistral Part No: NA; Tolerance: NA; Voltage: NA; Wattage: NA; Weight: NA; Temperature: NA; Datasheet: NA; MECHANICAL 3D STEP FILE: NA; Library Path: Y:\MIS_DATABASE\Library\ALTIUM_TOOL\SCHEMATICS_PARTS\MS_DISCRETE_Library.schlib; Footprint Path: Y:\MIS_DATABASE\Library\ALTIUM_TOOL\PCB_FOOTPRINTS\Altium_Footprint_Lib.PcbLib; Library Ref: TESTPOINT; Footprint Ref: TP20_SMD; RoHS: NA
TP58 = TESTPOINT: TESTPOINT CIR 20 SMD; Mfr_name: LOCAL; Mistral Part No: NA; Project: BT MODULE_CSRBC04; PCB Footprint: TP20_SMD; RoHS: NA; Chkd/date: SHREESHAIL/171006; Crtd /date: MAZHAR/171006; Height: NA; Distributor_part_number: NA; Distributor_name: NA; Package: SMD; Part_type: TESTPOINT; Mfr_part_number: TP20_SMD; Tolerance: NA; Voltage: NA; Wattage: NA; Weight: NA; Temperature: NA; Datasheet: NA; MECHANICAL 3D STEP FILE: NA; Library Path: Y:\MIS_DATABASE\Library\ALTIUM_TOOL\SCHEMATICS_PARTS\MS_DISCRETE_Library.schlib; Footprint Path: Y:\MIS_DATABASE\Library\ALTIUM_TOOL\PCB_FOOTPRINTS\Altium_Footprint_Lib.PcbLib; Library Ref: TESTPOINT; Footprint Ref: TP20_SMD; Customs_HS_Code: NA; Custom_Duty: NA
TP60 TP62 = TESTPOINT: TESTPOINT CIR 20 SMD; Mistral Part No: NA; Mfr_name: LOCAL; Project: BT MODULE_CSRBC04; PCB Footprint: TP20_SMD; RoHS: NA; Mfr_part_number: TP20_SMD; Part_type: TESTPOINT; Package: SMD; Distributor_name: NA; Distributor_part_number: NA; Height: NA; Crtd /date: MAZHAR/171006; Chkd/date: SHREESHAIL/171006; Tolerance: NA; Voltage: NA; Wattage: NA; Weight: NA; Temperature: NA; Datasheet: NA; MECHANICAL 3D STEP FILE: NA; Library Path: Y:\MIS_DATABASE\Library\ALTIUM_TOOL\SCHEMATICS_PARTS\MS_DISCRETE_Library.schlib; Footprint Path: Y:\MIS_DATABASE\Library\ALTIUM_TOOL\PCB_FOOTPRINTS\Altium_Footprint_Lib.PcbLib; Library Ref: TESTPOINT; Footprint Ref: TP20_SMD; Customs_HS_Code: NA; Custom_Duty: NA
U13 = MT40A512M16LY_FBGA96: IC 16Gb DDR4 SDRAM FBGA96; Part_type: ICS\DIGITAL\MEMORY; Mfr_name: MICRON; Mistral Part No: 141120080005-R; Custom_Duty: 15%; Customs_HS_Code: 85423100; Wattage: NA; Project: AM64x_EVM_BRD; PCB Footprint: FBGA96_31-49_520X360_1-2; Footprint Path: Y:\MIS_DATABASE\Library\ALTIUM_TOOL\PCB_FOOTPRINTS\Altium_Footprint_Lib.PcbLib; Library Path: Y:\MIS_DATABASE\Library\ALTIUM_TOOL\SCHEMATICS_PARTS\MS_MISCMEMORY_Library.schlib; MECHANICAL 3D STEP FILE: FBGA96_31-49_520X360_1-2; Chkd/date: MANIRAJA/280820; Crtd /date: ALVY/280820; Datasheet: Y:\MIS_DATABASE\DATASHEETS\ICS\MEMORY\MT40A-SER.PDF; Temperature: -40癈+95癈; Weight: NA; Height: 1.20MM; Library Ref: MT40A512M16LY_FBGA96; Distributor_part_number: 340-457244-TRAY; Distributor_name: MOUSER; Package: FBGA96; Voltage: NA; Tolerance: NA; Mfr_part_number: MT40A1G16KD-062E IT:E; Footprint Ref: FBGA96_31-49_520X360_1-2
U23 = XAM6442BSFGGAALV_BGA441: IC AM64x SoC MICROPROCESSOR BGA441; Mistral Part No: 141220080002; Mfr_name: TEXAS INSTRUMENTS; Part_type: ICS\DIGITAL\MICROPROCESSOR; Project: AM64x-GP_EVM BRD; Tolerance: NA; Customs_HS_Code: 85423100; Custom_Duty: 15%; PCB Footprint: FCBGA441_31-49_680X680_2-6; Footprint Ref: FCBGA441_31-49_680X680_2-6; Mfr_part_number: AM6442BSFGHAALV; Voltage: NA; Wattage: NA; Package: BGA441; Distributor_name: NA; Distributor_part_number: NA; Library Ref: XAM6442BSFGGAALV_BGA441; Height: 2.57MM; Weight: NA; Temperature: NA; Datasheet: Y:\MIS_DATABASE\DATASHEETS\ICS\DIGITAL\MICROCONTROLLER\AM64-SoC_SVB.PDF; Crtd /date: ALVY/300322; Chkd/date: ALVY/300322; RoHS: NA; MECHANICAL 3D STEP FILE: FCBGA441_31-49_680X680_2-6; Library Path: Y:\MIS_DATABASE\Library\ALTIUM_TOOL\SCHEMATICS_PARTS\MS_MICROPROCESSOR_Library.schlib; Footprint Path: Y:\MIS_DATABASE\Library\ALTIUM_TOOL\PCB_FOOTPRINTS\Altium_Footprint_Lib.PcbLib